# EAGLE design biggity (EAGLE 9.1.1)
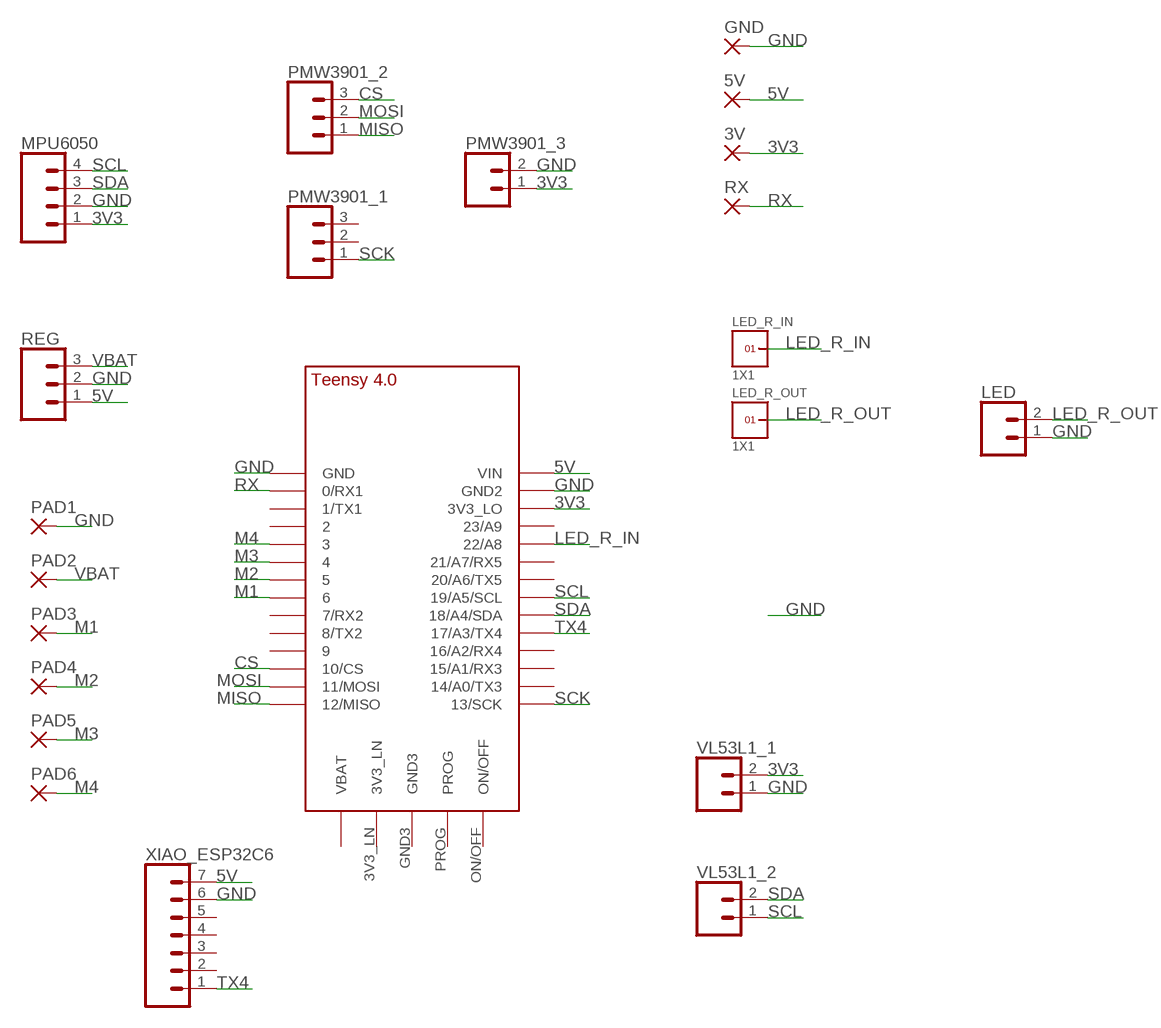
[diagram p0: schematic, sheet 1]

## Parts
3V  SMD2  [SMD1,27-2,54]
5V  SMD2  [SMD1,27-2,54]
GND  SMD2  [SMD1,27-2,54]
LED  CONN_021X02_NO_SILK  [1X02_NO_SILK]
LED_R_IN  1X1  [1X1]
LED_R_OUT  1X1  [1X1]
MPU6050  CONN_041X04_NO_SILK  [1X04_NO_SILK]
PAD1  SMD2  [SMD1,27-2,54]
PAD2  SMD2  [SMD1,27-2,54]
PAD3  SMD2  [SMD1,27-2,54]
PAD4  SMD2  [SMD1,27-2,54]
PAD5  SMD2  [SMD1,27-2,54]
PAD6  SMD2  [SMD1,27-2,54]
PMW3901_1  CONN_031X03_NO_SILK  [1X03_NO_SILK]
PMW3901_2  CONN_031X03_NO_SILK  [1X03_NO_SILK]
PMW3901_3  CONN_021X02_NO_SILK  [1X02_NO_SILK]
REG  CONN_031X03_NO_SILK  [1X03_NO_SILK]
RX  SMD2  [SMD1,27-2,54]
U$1  TEENSY_4.0  [TEENSY_4.0]
VL53L1_1  CONN_021X02_NO_SILK  [1X02_NO_SILK]
VL53L1_2  CONN_021X02_NO_SILK  [1X02_NO_SILK]
XIAO_ESP32C6  CONN_07NO_SILK  [1X07_NO_SILK]

## Nets
3V3: 3V.1(P) MPU6050.1 PMW3901_3.1 U$1.3V3_LO VL53L1_1.2
5V: 5V.1(P) REG.1 U$1.VIN XIAO_ESP32C6.7
CS: PMW3901_2.3 U$1.10/CS
GND: GND.1(P) LED.1 MPU6050.2 PAD1.1(P) PMW3901_3.2 REG.2 U$1.GND U$1.GND2 VL53L1_1.1 XIAO_ESP32C6.6
LED_R_IN: LED_R_IN.1 U$1.22/A8
LED_R_OUT: LED.2 LED_R_OUT.1
M1: PAD3.1(P) U$1.6
M2: PAD4.1(P) U$1.5
M3: PAD5.1(P) U$1.4/CANRX
M4: PAD6.1(P) U$1.3/CANTX
MISO: PMW3901_2.1 U$1.12/MISO
MOSI: PMW3901_2.2 U$1.11/MOSI
RX: RX.1(P) U$1.0/RX(0/RX1)
SCK: PMW3901_1.1 U$1.13/SCK
SCL: MPU6050.4 U$1.19/A5/SCL VL53L1_2.1
SDA: MPU6050.3 U$1.18/A4/SDA VL53L1_2.2
TX4: U$1.17/A3(17/A3/TX4) XIAO_ESP32C6.1
VBAT: PAD2.1(P) REG.3
Unconnected: PMW3901_1.2 PMW3901_1.3 U$1.1/TX(1/TX1) U$1.2 U$1.3V3_LN U$1.7(7/RX2) U$1.8(8/TX2) U$1.9/CS U$1.14/A0(14/A0/TX3) U$1.15/A1(15/A1/RX3) U$1.16/A2(16/A2/RX4) U$1.20/A6(20/A6/TX5) U$1.21/A7(21/A7/RX5) U$1.23/A9 U$1.GND3 U$1.ON/OFF U$1.PROG U$1.VBAT\(VBAT) XIAO_ESP32C6.2 XIAO_ESP32C6.3 XIAO_ESP32C6.4 XIAO_ESP32C6.5

## Library data of the parts
3V 5V GND PAD1-PAD6 RX = wirepad:SMD2: SMD PAD
LED PMW3901_3 VL53L1_1 VL53L1_2 = SparkFun-Connectors:CONN_02: Multi connection point. Often used as Generic Header-pin footprint for 0.1 inch spaced/style header connections On any of the 0.1 inch spaced packages, you can populate with these: Break Away Headers - Straight <https://www.sparkfun.com/products/116> (PRT-00116) Break Away Male Headers - Right Angle <https://www.sparkfun.com/products/553> (PRT-00553) Female Headers <https://www.sparkfun.com/products/115> (PRT-00115) Break Away Headers - Machine Pin <https://www.sparkfun.com/products/117> (PRT-00117) Break Away Female Headers - Swiss Machine Pin <https://www.sparkfun.com/products/743> (PRT-00743) For SCREWTERMINALS and SPRING TERMINALS visit here: Screw Terimnals on SparkFun.com <https://www.sparkfun.com/search/results?term=Screw+Terminals> (5mm/3.5mm/2.54mm spacing) This device is also useful as a general connection point to wire up your design to another part of your project. Our various solder wires solder well into these plated through hole pads. Hook-Up Wire - Assortment (Stranded, 22 AWG) <https://www.sparkfun.com/products/11375> (PRT-11375) Hook-Up Wire - Assortment (Solid Core, 22 AWG) <https://www.sparkfun.com/products/11367> (PRT-11367) View the entire wire category on our website here <https://www.sparkfun.com/categories/141> Special notes: Molex polarized connector foot print use with: PRT-08233 with associated crimp pins and housings. 2.54_SCREWTERM for use with PRT-10571. 3.5mm Screw Terminal footprints for PRT-08084 5mm Screw Terminal footprints for use with PRT-08432
LED_R_IN LED_R_OUT = headers(2mm):1X1
MPU6050 = SparkFun-Connectors:CONN_04: Multi connection point. Often used as Generic Header-pin footprint for 0.1 inch spaced/style header connections On any of the 0.1 inch spaced packages, you can populate with these: Break Away Headers - Straight <https://www.sparkfun.com/products/116> (PRT-00116) Break Away Male Headers - Right Angle <https://www.sparkfun.com/products/553> (PRT-00553) Female Headers <https://www.sparkfun.com/products/115> (PRT-00115) Break Away Headers - Machine Pin <https://www.sparkfun.com/products/117> (PRT-00117) Break Away Female Headers - Swiss Machine Pin <https://www.sparkfun.com/products/743> (PRT-00743) For SCREWTERMINALS and SPRING TERMINALS visit here: Screw Terimnals on SparkFun.com <https://www.sparkfun.com/search/results?term=Screw+Terminals> (5mm/3.5mm/2.54mm spacing) This device is also useful as a general connection point to wire up your design to another part of your project. Our various solder wires solder well into these plated through hole pads. Hook-Up Wire - Assortment (Stranded, 22 AWG) <https://www.sparkfun.com/products/11375> (PRT-11375) Hook-Up Wire - Assortment (Solid Core, 22 AWG) <https://www.sparkfun.com/products/11367> (PRT-11367) View the entire wire category on our website here <https://www.sparkfun.com/categories/141> Special notes: Molex polarized connector foot print use with SKU : PRT-08231 with associated crimp pins and housings. 1MM SMD Version SKU: PRT-10208; PROD_ID: CONN-09696
PMW3901_1 PMW3901_2 REG = SparkFun-Connectors:CONN_03: Multi connection point. Often used as Generic Header-pin footprint for 0.1 inch spaced/style header connections On any of the 0.1 inch spaced packages, you can populate with these: Break Away Headers - Straight <https://www.sparkfun.com/products/116> (PRT-00116) Break Away Male Headers - Right Angle <https://www.sparkfun.com/products/553> (PRT-00553) Female Headers <https://www.sparkfun.com/products/115> (PRT-00115) Break Away Headers - Machine Pin <https://www.sparkfun.com/products/117> (PRT-00117) Break Away Female Headers - Swiss Machine Pin <https://www.sparkfun.com/products/743> (PRT-00743) Stackable Header - 3 Pin (Female, 0.1") <https://www.sparkfun.com/products/13875> (PRT-13875) For SCREWTERMINALS and SPRING TERMINALS visit here: Screw Terimnals on SparkFun.com <https://www.sparkfun.com/search/results?term=Screw+Terminals> (5mm/3.5mm/2.54mm spacing) This device is also useful as a general connection point to wire up your design to another part of your project. Our various solder wires solder well into these plated through hole pads. Hook-Up Wire - Assortment (Stranded, 22 AWG) <https://www.sparkfun.com/products/11375> (PRT-11375) Hook-Up Wire - Assortment (Solid Core, 22 AWG) <https://www.sparkfun.com/products/11367> (PRT-11367) View the entire wire category on our website here <https://www.sparkfun.com/categories/141> Special notes: Molex polarized connector foot print use with SKU : PRT-08232 with associated crimp pins and housings.
U$1 = TEENSY 4.0:TEENSY_4.0
XIAO_ESP32C6 = SparkFun-Connectors:CONN_07: Multi connection point. Often used as Generic Header-pin footprint for 0.1 inch spaced/style header connections On any of the 0.1 inch spaced packages, you can populate with these: Break Away Headers - Straight <https://www.sparkfun.com/products/116> (PRT-00116) Break Away Male Headers - Right Angle <https://www.sparkfun.com/products/553> (PRT-00553) Female Headers <https://www.sparkfun.com/products/115> (PRT-00115) Break Away Headers - Machine Pin <https://www.sparkfun.com/products/117> (PRT-00117) Break Away Female Headers - Swiss Machine Pin <https://www.sparkfun.com/products/743> (PRT-00743) For SCREWTERMINALS and SPRING TERMINALS visit here: Screw Terimnals on SparkFun.com <https://www.sparkfun.com/search/results?term=Screw+Terminals> (5mm/3.5mm/2.54mm spacing) This device is also useful as a general connection point to wire up your design to another part of your project. Our various solder wires solder well into these plated through hole pads. Hook-Up Wire - Assortment (Stranded, 22 AWG) <https://www.sparkfun.com/products/11375> (PRT-11375) Hook-Up Wire - Assortment (Solid Core, 22 AWG) <https://www.sparkfun.com/products/11367> (PRT-11367) View the entire wire category on our website here <https://www.sparkfun.com/categories/141> Special notes: Molex polarized connector foot print use with SKU : PRT-08231 with associated crimp pins and housings. 1MM SMD Version SKU: PRT-10208 NOTES ON THE VARIANTS LOCK and LOCK_LONGPADS... This footprint was designed to help hold the alignment of a through-hole component (i.e. 6-pin header) while soldering it into place. You may notice that each hole has been shifted either up or down by 0.005 of an inch from it's more standard position (which is a perfectly straight line). This slight alteration caused the pins (the squares in the middle) to touch the edges of the holes. Because they are alternating, it causes a "brace" to hold the component in place. 0.005 has proven to be the perfect amount of "off-center" position when using our standard breakaway headers. Although looks a little odd when you look at the bare footprint, once you have a header in there, the alteration is very hard to notice. Also,if you push a header all the way into place, it is covered up entirely on the bottom side.

## Board
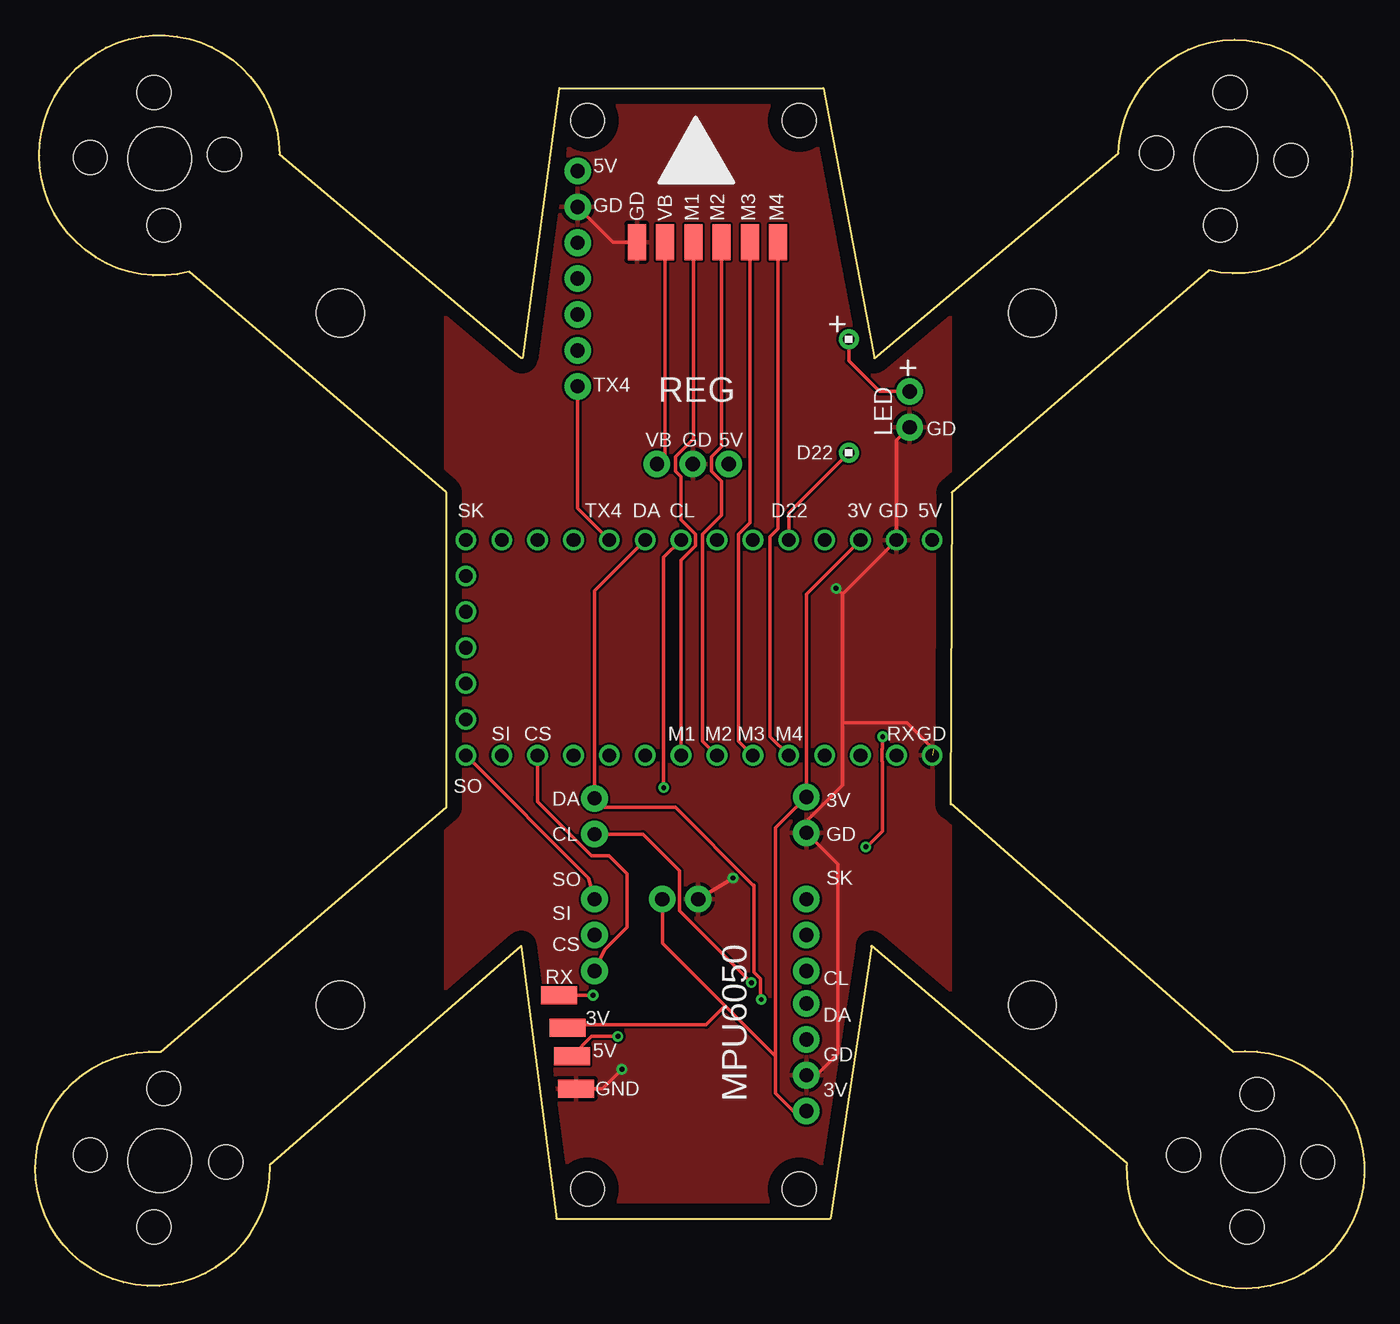
[diagram p1: board, top side]
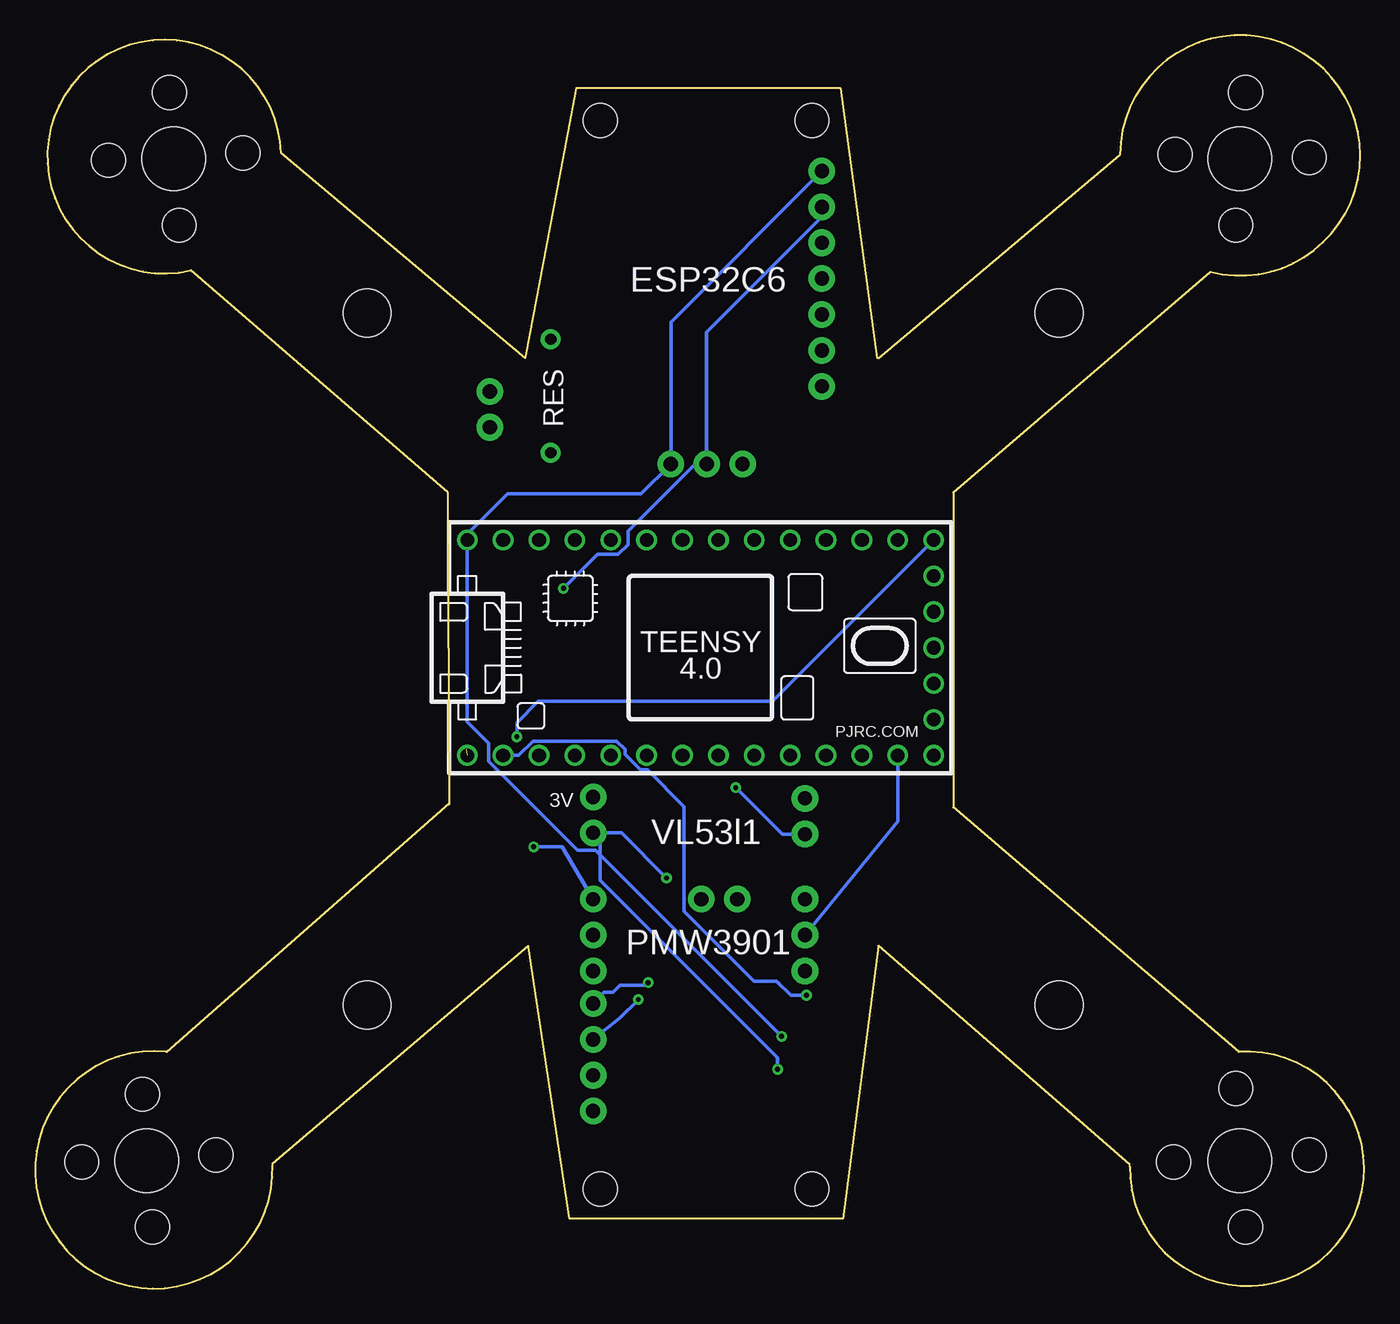
[diagram p2: board, bottom side, seen from below]

Size 94.08 x 88.7 mm. Coordinates in mm from the lower left corner, seen from the top.
Outline: 64.79,34.26 64.89,56.36 83.09,72.06 arc281 76.69,80.36 59.39,65.86 55.79,84.96 37.09,84.96 34.49,65.86
Outline: 59.19,24.16 56.29,4.96 36.89,4.96 34.39,24.26 16.59,8.76
Outline: 64.79,34.36 84.79,16.76 arc-279 77.29,8.76
Outline: 77.29,8.86 59.19,24.26
Outline: 34.39,65.86 17.29,80.26 arc284 10.89,71.96 29.09,56.36 29.09,34.06 8.89,16.76 arc275 16.59,8.66
Copper layers (1*16): Top 0.035mm / dielectric 1.5mm / Bottom 0.035mm
Design rules "default": minimum track width 6mil, minimum drill 0.35mm, track to track 6mil, track to pad 6mil, pad to pad 6mil, via to via 6mil, smd to smd 6mil, copper to edge 40mil, drill to drill 6mil, minimum pad ring 10mil, minimum via ring 8mil, stop-mask expansion 4mil, vias tented up to drill 0mil, thermal gap 10mil
Holes 2.4 mm at 39.09,7.06 54.09,7.06 84.59,84.66 83.89,75.26 79.39,80.36 88.89,79.86 8.39,84.66 9.09,75.26 3.89,80.06 13.39,80.26 86.49,13.76 85.79,4.36 81.29,9.46 90.79,8.96 9.09,14.16 8.39,4.36 3.89,9.46 13.49,8.96 39.09,82.66 54.09,82.66
Holes 4.5 mm at 84.29,79.96 8.79,79.96 86.19,9.06 8.79,9.06
Holes 3.4 mm at 21.59,69.06 70.59,69.06 70.59,20.06 21.59,20.06

### Footprints (pad centres in the part's own frame; a part is rotated, then mirrored left to right if it is on the bottom)
SMD1,27-2,54 = smd 1.27 x 2.54: 1 0,0
1X02_NO_SILK = drill 1.016 pad 1.88: 1 0,0; 2 2.54,0
1X1 = drill 0.8 pad 1.422: 1 0,0
1X04_NO_SILK = drill 1.016 pad 1.88: 1 0,0; 2 2.54,0; 3 5.08,0; 4 7.62,0
1X03_NO_SILK = drill 1.016 pad 1.88: 1 0,0; 2 2.54,0; 3 5.08,0
TEENSY_4.0 = drill 0.965: 0/RX -13.97,-7.62; 1/TX -11.43,-7.62; 2 -8.89,-7.62; 3/CANTX -6.35,-7.62; 3V3_LN 16.51,-2.54; 3V3_LO -11.43,7.62; 4/CANRX -3.81,-7.62; 5 -1.27,-7.62; 6 1.27,-7.62; 7 3.81,-7.62; 8 6.35,-7.62; 9/CS 8.89,-7.62; 10/CS 11.43,-7.62; 11/MOSI 13.97,-7.62; 12/MISO 16.51,-7.62; 13/SCK 16.51,7.62; 14/A0 13.97,7.62; 15/A1 11.43,7.62; 16/A2 8.89,7.62; 17/A3 6.35,7.62; 18/A4/SDA 3.81,7.62; 19/A5/SCL 1.27,7.62; 20/A6 -1.27,7.62; 21/A7 -3.81,7.62; 22/A8 -6.35,7.62; 23/A9 -8.89,7.62; GND -16.51,-7.62; GND2 -13.97,7.62; GND3 16.51,0; ON/OFF 16.51,5.08; PROG 16.51,2.54; VBAT\ 16.51,-5.08; VIN -16.51,7.62
1X07_NO_SILK = drill 1.016 pad 1.88: 1 0,0; 2 2.54,0; 3 5.08,0; 4 7.62,0; 5 10.16,0; 6 12.7,0; 7 15.24,0

### Placement (x,y rotation side)
3V  37.69,18.46 90 top
5V  37.99,16.46 90 top
GND  38.29,14.16 90 top
LED  61.89,60.96 90 top
LED_R_IN  57.59,59.16 0 top
LED_R_OUT  57.59,67.19 0 top
MPU6050  54.59,12.56 90 top
PAD1  42.59,74.06 0 top
PAD2  44.59,74.06 0 top
PAD3  46.59,74.06 0 top
PAD4  48.59,74.06 0 top
PAD5  50.59,74.06 0 top
PAD6  52.59,74.06 0 top
PMW3901_1  54.59,27.56 270 top
PMW3901_2  39.59,27.56 270 top
PMW3901_3  44.39,27.56 0 top
REG  49.09,58.36 180 top
RX  37.09,20.76 90 top
U$1  46.99,45.36 0 bottom
VL53L1_1  54.59,32.26 90 top
VL53L1_2  39.59,32.16 90 top
XIAO_ESP32C6  38.39,63.86 90 top

### Tracks (layer width: path | path; a pad name or v marks a point on that pad's centre or on a via)
3V3
  Top 0.254: U$1.3V3_LO 54.59,49.15 VL53L1_1.2 52.42,32.62 52.42,16.43 | 52.42,16.43 51.52,17.33 48.84,20 | PMW3901_3.1 44.39,24.45 48.84,20 | 48.84,20 47.49,18.66 37.89,18.66 3V.1 | 52.42,16.43 52.42,13.83 53.69,12.56 MPU6050.1
5V  (via drill 0.35)
  Top 0.254: v41.24,17.85 39.38,17.85 5V.1
  Bottom 0.254: v41.24,17.85 54.43,31.04 55.7,31.04 61.98,37.32 61.98,38.58 63.5,40.11 U$1.VIN 63.5,53.4 60.65,56.25 52.99,56.25 | 52.87,56.25 52.99,56.25 | XIAO_ESP32C6.7 49.09,68.4 REG.1 51.2,56.25 52.99,56.25
CS
  Top 0.254: U$1.10/CS 35.56,34.86 | 35.56,34.86 35.56,34.46 | 35.56,34.46 39.39,30.64 40.61,30.64 41.89,29.36 41.89,25.56 40.31,23.98 PMW3901_2.3 | 35.56,34.46 35.56,34.86
GND  (via drill 0.35)  (1 unrouted)
  Top 0.254: U$1.GND2 57.13,49.15 | 57.13,49.15 57.13,40.06 | 57.13,40.06 57.13,35.61 54.59,33.07 VL53L1_1.1 | 56.83,23.39 56.83,23.06 | 56.83,23.06 56.83,16.64 55.29,15.1 MPU6050.2 | VL53L1_1.1 54.79,32.05 | v41.53,15.52 40.17,14.16 GND.1 | 57.13,40.06 61.69,40.06 63.59,38.16 | VL53L1_1.1 56.83,30.02 56.83,23.06 | v49.39,29.06 PMW3901_3.2 | XIAO_ESP32C6.6 40.89,74.06 PAD1.1 | 60.69,53.25 U$1.GND2 | 57.13,49.15 56.72,49.56 v56.69,49.56 | LED.1 60.96,60.03 U$1.GND2
  Bottom 0.254: v49.39,29.06 52.59,32.26 VL53L1_1.1 54.09,31.76 54.09,28.88 41.53,16.32 v41.53,15.52 | XIAO_ESP32C6.6 38.39,75.86 46.55,67.7 REG.2 47.37,58.36 52.13,53.6 52.13,52.66 52.82,51.96 54.29,51.96 v56.69,49.56
  pour Top: 64.74,98.21 64.74,-3.49 29.09,-3.49 29.09,98.21
LED_R_IN
  Top 0.254: LED_R_IN.1 53.34,54.91 U$1.22/A8
LED_R_OUT
  Top 0.254: LED_R_OUT.1 57.59,65.66 59.75,63.5 LED.2
M1
  Top 0.254: U$1.6 45.72,51.54 46.74,52.56 46.74,53.4 45.71,54.42 45.71,57.47 45.33,57.85 45.33,58.86 46.61,60.14 46.61,72.68 46.59,72.7 PAD3.1
M2
  Top 0.254: 48.15,54.3 48.05,54.2 | 48.05,54.2 47.25,53.4 47.25,38.75 U$1.5 | 48.05,54.2 48.59,54.74 48.59,57.13 47.87,57.85 47.87,58.86 48.59,59.58 PAD4.1
M3
  Top 0.254: PAD5.1 50.59,54.2 49.79,53.4 49.79,38.75 U$1.4/CANRX
M4
  Top 0.254: PAD6.1 52.59,53.76 52.03,53.2 52.03,39.05 U$1.3/CANTX
MISO
  Top 0.254: U$1.12/MISO 39.16,29.06 PMW3901_2.1
MOSI
  Bottom 0.254: U$1.11/MOSI 33.02,33.09 PMW3901_2.2
RX  (via drill 0.35)
  Top 0.254: RX.1 37.09,20.86 37.19,20.76 v39.49,20.76
  Bottom 0.254: U$1.0/RX 59.86,37.74 58.84,38.75 52.92,38.75 52.33,38.16 52.33,37.82 51.22,36.72 50.76,36.72 48.15,34.12 48.15,26.72 43.19,21.76 41.59,21.76 | 41.59,21.76 41.46,21.63 | 41.59,21.76 40.59,20.76 v39.49,20.76
SCK  (via drill 0.35)
  Top 0.254: v59.99,39.06 59.99,38.2 59.95,38.16 59.95,37.32 59.99,37.27 59.99,32.36 58.89,31.26 v58.79,31.26
  Bottom 0.254: U$1.13/SCK 41.9,41.56 58.49,41.56 59.99,40.06 v59.99,39.06 | v58.79,31.26 56.79,31.26 PMW3901_1.1
SCL  (via drill 0.35)
  Top 0.254: 39.09,32.16 VL53L1_2.1 43.02,32.16 45.61,29.56 45.61,26.74 v50.69,21.66 | U$1.19/A5/SCL 44.49,51.75 v44.49,35.46
  Bottom 0.254: v44.49,35.46 41.19,32.16 VL53L1_2.1 | v50.69,21.66 50.89,21.46 52.67,21.46 53.17,20.96 53.8,20.97 MPU6050.4
SDA  (via drill 0.35)
  Top 0.254: U$1.18/A4/SDA 39.59,49.39 VL53L1_2.2 40.23,34.06 45.32,34.06 50.82,28.56 50.89,28.56 50.89,22.39 51.35,21.93 51.35,20.7 51.39,20.66 v51.39,20.46
  Bottom 0.254: v51.39,20.46 52.71,19.14 MPU6050.3
  other vias: 54.59,17.64
TX4
  Top 0.254: XIAO_ESP32C6.1 38.39,55.23 U$1.17/A3
VBAT
  Top 0.254: PAD2.1 44.59,58.94 REG.3

### Text on the board
tNames: 5V | GD | GD | VB | M1 | M2 | M3 | M4 | + | + | TX4 | REG | LED | GD | VB | GD | 5V | D22 | SK | TX4 | DA | CL | D22 | 3V | GD | 5V | SI | CS | M1 | M2 | M3 | M4 | RX | GD | SO | DA | 3V | CL | GD | SK | SO | SI | CS | MPU6050 | CL | DA | GD | 3V
bNames: ESP32C6 | RES | 3V | VL53l1 | PMW3901